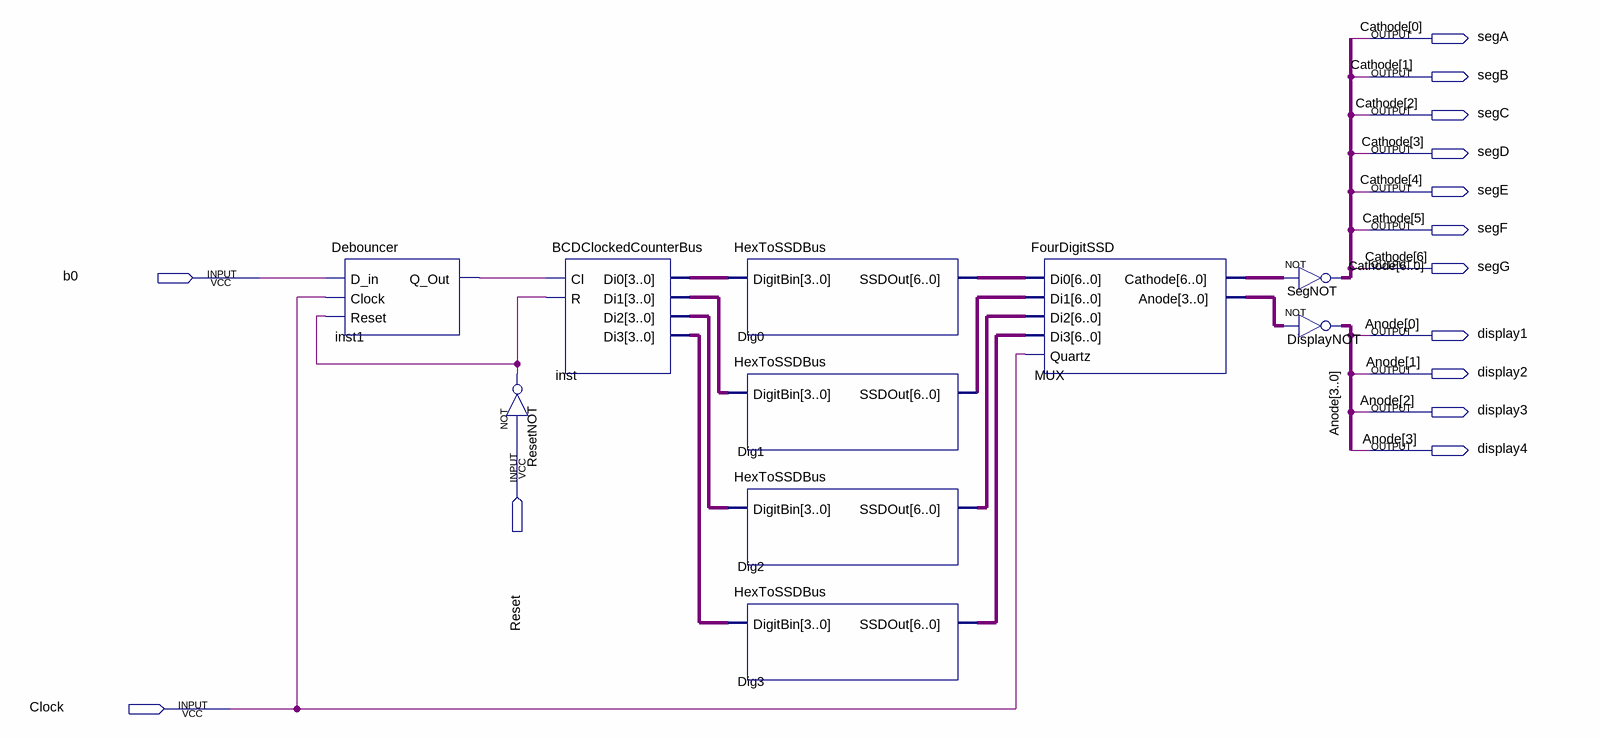
[diagram p0: schematic sheet]
// Quartus schematic FPGADebouncer.bdf as structural Verilog: 10 symbols, 14 pins
module FPGADebouncer (
  input  b0,
  input  Reset,
  input  Clock,
  output segA,
  output segB,
  output segC,
  output segD,
  output segE,
  output segF,
  output segG,
  output display1,
  output display2,
  output display3,
  output display4
);

  wire inst1_q_out, ResetNOT_out;
  wire [3:0] inst_di0, inst_di1, inst_di2, inst_di3, MUX_anode;
  wire [6:0] Dig0_ssdout, Dig1_ssdout, Dig2_ssdout, Dig3_ssdout, MUX_cathode;

  Debouncer inst1 (.D_in(b0), .Clock(Clock), .Reset(ResetNOT_out), .Q_Out(inst1_q_out));
  not ResetNOT (ResetNOT_out, Reset);
  BCDClockedCounterBus inst (
    .Cl(inst1_q_out), .R(ResetNOT_out), .Di0(inst_di0), .Di1(inst_di1), .Di2(inst_di2), .Di3(inst_di3));
  HexToSSDBus Dig0 (.DigitBin(inst_di0), .SSDOut(Dig0_ssdout));
  HexToSSDBus Dig1 (.DigitBin(inst_di1), .SSDOut(Dig1_ssdout));
  HexToSSDBus Dig2 (.DigitBin(inst_di2), .SSDOut(Dig2_ssdout));
  HexToSSDBus Dig3 (.DigitBin(inst_di3), .SSDOut(Dig3_ssdout));
  FourDigitSSD MUX (
    .Di0(Dig0_ssdout), .Di1(Dig1_ssdout), .Di2(Dig2_ssdout), .Di3(Dig3_ssdout), .Quartz(Clock),
    .Cathode(MUX_cathode), .Anode(MUX_anode));
  assign {segG, segF, segE, segD, segC, segB, segA} = ~MUX_cathode;  // NOT SegNOT, 7 bits wide
  assign {display4, display3, display2, display1} = ~MUX_anode;  // NOT DisplayNOT, 4 bits wide

  // Other names for the same wires on the sheet: Anode[3:0] = {display4, display3, display2, display1};
  //   Cathode[6:0] = {segG, segF, segE, segD, segC, segB, segA}
endmodule
